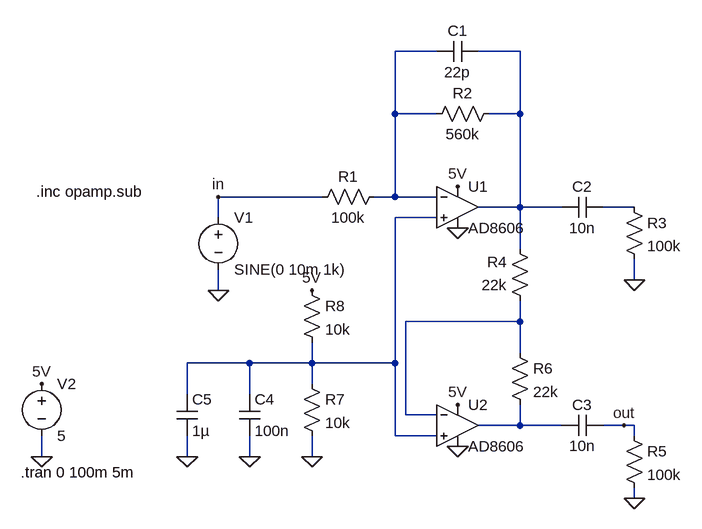
[diagram p0: schematic Draft2.asc]
Draft2.asc, the LTspice schematic file:
Version 4
SHEET 1 880 680
WIRE 128 -160 64 -160
WIRE 256 -160 192 -160
WIRE 64 -64 64 -160
WIRE 128 -64 64 -64
WIRE 256 -64 256 -160
WIRE 256 -64 208 -64
WIRE -48 64 -208 64
WIRE 64 64 64 -64
WIRE 64 64 32 64
WIRE 128 64 64 64
WIRE 256 80 256 -64
WIRE 256 80 192 80
WIRE 320 80 256 80
WIRE 432 80 384 80
WIRE -208 96 -208 64
WIRE 128 96 64 96
WIRE 256 144 256 80
WIRE 432 192 432 160
WIRE -208 208 -208 176
WIRE 256 256 256 224
WIRE 256 256 80 256
WIRE 256 304 256 256
WIRE -160 320 -256 320
WIRE -64 320 -64 288
WIRE -64 320 -160 320
WIRE 64 320 64 96
WIRE 64 320 -64 320
WIRE -64 352 -64 320
WIRE -256 368 -256 320
WIRE -160 368 -160 320
WIRE 80 400 80 256
WIRE 128 400 80 400
WIRE 256 416 256 384
WIRE 256 416 192 416
WIRE 320 416 256 416
WIRE 416 416 384 416
WIRE 432 416 416 416
WIRE 64 432 64 320
WIRE 128 432 64 432
WIRE 432 432 432 416
WIRE -480 464 -480 432
WIRE -256 464 -256 432
WIRE -160 464 -160 432
WIRE -64 464 -64 432
WIRE 432 528 432 512
FLAG -256 464 0
FLAG -160 464 0
FLAG -64 464 0
FLAG -208 208 0
FLAG -480 464 0
FLAG -480 352 5V
FLAG -64 208 5V
FLAG 432 528 0
FLAG 432 192 0
FLAG -208 64 in
FLAG 416 416 out
FLAG 160 48 5V
FLAG 160 384 5V
FLAG 160 112 0
FLAG 160 448 0
SYMBOL res 48 48 R90
WINDOW 0 0 56 VBottom 2
WINDOW 3 32 56 VTop 2
SYMATTR InstName R1
SYMATTR Value 100k
SYMBOL res 224 -80 R90
WINDOW 0 0 56 VBottom 2
WINDOW 3 32 56 VTop 2
SYMATTR InstName R2
SYMATTR Value 560k
SYMBOL cap 192 -176 R90
WINDOW 0 0 32 VBottom 2
WINDOW 3 32 32 VTop 2
SYMATTR InstName C1
SYMATTR Value 22p
SYMBOL res 272 240 R180
WINDOW 0 36 76 Left 2
WINDOW 3 36 40 Left 2
SYMATTR InstName R4
SYMATTR Value 22k
SYMBOL res 240 288 R0
SYMATTR InstName R6
SYMATTR Value 22k
SYMBOL res -80 336 R0
SYMATTR InstName R7
SYMATTR Value 10k
SYMBOL res -80 192 R0
SYMATTR InstName R8
SYMATTR Value 10k
SYMBOL cap -176 368 R0
SYMATTR InstName C4
SYMATTR Value 100n
SYMBOL cap -272 368 R0
SYMATTR InstName C5
SYMATTR Value 1µ
SYMBOL voltage -208 80 R0
WINDOW 123 0 0 Left 0
WINDOW 39 0 0 Left 0
SYMATTR InstName V1
SYMATTR Value SINE(0 10m 1k)
SYMBOL voltage -480 336 R0
WINDOW 123 0 0 Left 0
WINDOW 39 0 0 Left 0
SYMATTR InstName V2
SYMATTR Value 5
SYMBOL cap 384 64 R90
WINDOW 0 0 32 VBottom 2
WINDOW 3 32 32 VTop 2
SYMATTR InstName C2
SYMATTR Value 10n
SYMBOL res 416 64 R0
SYMATTR InstName R3
SYMATTR Value 100k
SYMBOL cap 384 400 R90
WINDOW 0 0 32 VBottom 2
WINDOW 3 32 32 VTop 2
SYMATTR InstName C3
SYMATTR Value 10n
SYMBOL res 416 416 R0
SYMATTR InstName R5
SYMATTR Value 100k
SYMBOL OpAmps\\AD8606 160 16 R0
SYMATTR InstName U1
SYMBOL OpAmps\\AD8606 160 352 R0
SYMATTR InstName U2
TEXT -512 488 Left 2 !.tran 0 100m 5m
TEXT -488 56 Left 2 !.inc opamp.sub

The netlist it stands for:
* Draft2.asc
R1 N001 in 100k
R2 N002 N001 560k
C1 N002 N001 22p
R4 N005 N002 22k
R6 N005 N006 22k
R7 N004 0 10k
R8 5V N004 10k
C4 N004 0 100n
C5 N004 0 1µ
V1 in 0 SINE(0 10m 1k)
V2 5V 0 5
C2 N003 N002 10n
R3 N003 0 100k
C3 out N006 10n
R5 out 0 100k
XU1 N004 N001 5V 0 N002 AD8606  ; pins In+ In- V+ V- OUT
XU2 N004 N005 5V 0 N006 AD8606  ; pins In+ In- V+ V- OUT
.tran 0 100m 5m
.inc opamp.sub
.lib ADI.lib
.backanno
.end